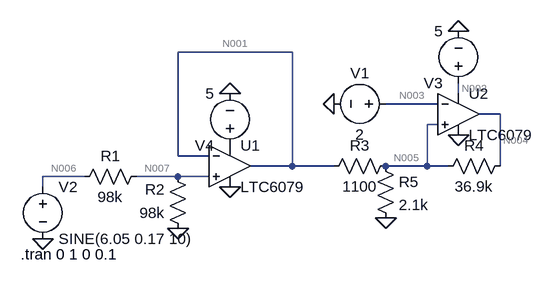
[diagram p0: schematic Draft1.asc]
Draft1.asc, the LTspice schematic file:
Version 4
SHEET 1 1268 680
WIRE 496 0 320 0
WIRE 752 64 752 48
WIRE 720 80 640 80
WIRE 816 96 784 96
WIRE 720 112 704 112
WIRE 320 160 320 0
WIRE 368 160 320 160
WIRE 496 176 496 0
WIRE 496 176 432 176
WIRE 560 176 496 176
WIRE 704 176 704 112
WIRE 704 176 640 176
WIRE 736 176 704 176
WIRE 816 176 816 96
WIRE 176 192 112 192
WIRE 320 192 256 192
WIRE 368 192 320 192
WIRE 112 208 112 192
FLAG 112 288 0
FLAG 400 208 0
FLAG 752 128 0
FLAG 400 64 0
FLAG 752 -32 0
FLAG 320 272 0
FLAG 640 256 0
FLAG 560 80 0
SYMBOL voltage 112 192 R0
WINDOW 123 0 0 Left 0
WINDOW 39 0 0 Left 0
SYMATTR InstName V2
SYMATTR Value SINE(6.05 0.17 10)
SYMBOL voltage 752 64 R180
WINDOW 123 0 0 Left 0
WINDOW 39 0 0 Left 0
SYMATTR InstName V3
SYMATTR Value 5
SYMBOL voltage 400 160 R180
WINDOW 123 0 0 Left 0
WINDOW 39 0 0 Left 0
SYMATTR InstName V4
SYMATTR Value 5
SYMBOL res 272 176 R90
WINDOW 0 0 56 VBottom 2
WINDOW 3 32 56 VTop 2
SYMATTR InstName R1
SYMATTR Value 98k
SYMBOL res 336 288 R180
WINDOW 0 36 76 Left 2
WINDOW 3 36 40 Left 2
SYMATTR InstName R2
SYMATTR Value 98k
SYMBOL OpAmps\\LTC6079 400 176 R0
SYMATTR InstName U1
SYMBOL OpAmps\\LTC6079 752 96 R0
SYMATTR InstName U2
SYMBOL res 832 160 R90
WINDOW 0 0 56 VBottom 2
WINDOW 3 32 56 VTop 2
SYMATTR InstName R4
SYMATTR Value 36.9k
SYMBOL res 656 160 R90
WINDOW 0 0 56 VBottom 2
WINDOW 3 32 56 VTop 2
SYMATTR InstName R3
SYMATTR Value 1100
SYMBOL res 624 160 R0
SYMATTR InstName R5
SYMATTR Value 2.1k
SYMBOL voltage 656 80 R90
WINDOW 0 -32 56 VBottom 2
WINDOW 3 32 56 VTop 2
WINDOW 123 0 0 Left 0
WINDOW 39 0 0 Left 0
SYMATTR InstName V1
SYMATTR Value 2
TEXT 78 312 Left 2 !.tran 0 1 0 0.1

The netlist it stands for:
* Draft1.asc
V2 N006 0 SINE(6.05 0.17 10)
V3 N002 0 5
V4 P001 0 5
R1 N007 N006 98k
R2 0 N007 98k
XU1 N007 N001 P001 0 N001 LTC6078  ; LTC6079, pins In+ In- V+ V- OUT
XU2 N005 N003 N002 0 N004 LTC6078  ; LTC6079, pins In+ In- V+ V- OUT
R4 N004 N005 36.9k
R3 N005 N001 1100
R5 N005 0 2.1k
V1 N003 0 2
.tran 0 1 0 0.1
.lib LTC5.lib
.backanno
.end

* Results of the author's LTspice run, read from the files saved beside the schematic
* Operating Point, zero values left out:
*   V(n006) = 6.05 V
*   V(n002) = 5 V
*   V(p001) = 5 V
*   V(n007) = 3.025 V
*   V(n001) = 3.025 V
*   V(n005) = 2.043 V
*   V(n003) = 2 V
*   V(n004) = 4.996 V
*   I(R5) = 972.8 µA
*   I(R3) = -892.8 µA
*   I(R4) = 80.03 µA
*   I(R2) = -30.87 µA
*   I(R1) = -30.87 µA
*   I(V4) = -928.6 µA
*   I(V3) = -116.1 µA
*   I(V2) = -30.87 µA
*   Ix(u1:3) = 928.6 µA
*   Ix(u1:4) = -35.84 µA
*   Ix(u1:5) = -892.8 µA
*   Ix(u2:3) = 116.1 µA
*   Ix(u2:4) = -36.04 µA
*   Ix(u2:5) = -80.03 µA
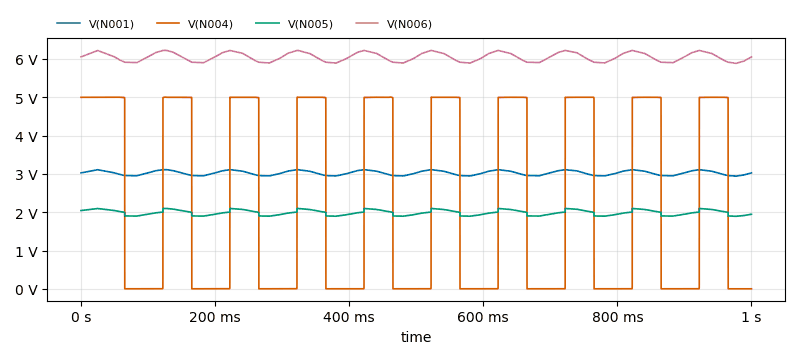
[diagram p1: Transient Analysis of Draft1.asc, plotted from the saved traces]
* Transient Analysis, 1 run:
*   V(N001): min 2.941 V, max 3.11 V, average 3.025 V, rms 3.025 V, last 3.025 V
*   V(N004): min 2.739 mV, max 5.003 V, average 2.261 V, rms 3.359 V, last 2.819 mV
*   V(N005): min 1.893 V, max 2.098 V, average 1.99 V, rms 1.991 V, last 1.947 V
*   V(N006): min 5.881 V, max 6.22 V, average 6.049 V, rms 6.05 V, last 6.05 V